# EAGLE schematic rectifier-power (EAGLE 5.07)
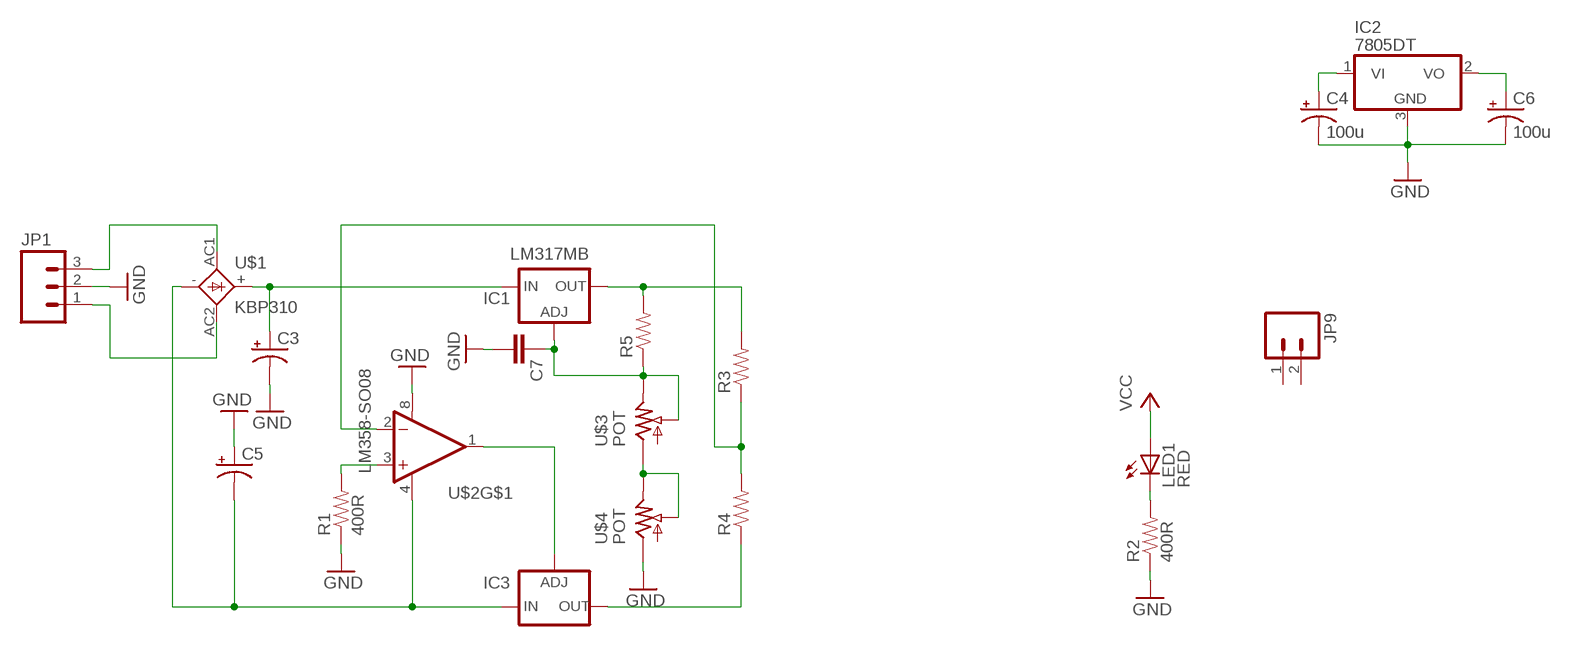
[diagram p0: schematic, sheet 1]

## Parts
C3  CAP_POLPTH3  [CPOL-RADIAL-1000UF-63V]
C4  100u  CAP_POLD  [PANASONIC_D]
C5  CAP_POLPTH3  [CPOL-RADIAL-1000UF-63V]
C6  100u  CAP_POLD  [PANASONIC_D]
C7  CAP-C1206  [C1206]
IC1  LM317MB  [TO220L1]
IC2  7805DT  [TO252]
IC3  LM337TL  [337TL]
JP1  M03-SCREW-5MM  [SCREWTERMINAL-5MM-3]
JP9  CON-02-XH  [XH-1X2-LONG-LOCK]
LED1  RED  LEDSIDELED  [OSRAM-SIDELED]
R1  400R  RESISTOR1/4W-RF  [AXIAL-0.3-SMD]
R2  400R  RESISTOR1/4W-RF  [AXIAL-0.3-SMD]
R3  RESISTOR1/4W-RF  [AXIAL-0.3-SMD]
R4  RESISTOR1/4W-RF  [AXIAL-0.3-SMD]
R5  RESISTOR-R0805W  [R0805W]
U$1  KBP310  RECTIFIER-BRIDGE  [KBP310]
U$2  LM358-SO08  [SO08]
U$3  POT  POTPANNEL  [POT-PANNEL]
U$4  POT  POTPANNEL  [POT-PANNEL]

## Nets
GND: C3.2(-) C4.- C5.1(+) C6.- C7.2 IC2.3(GND) JP1.2 R1.P$1 R2.P$1 U$2.8(V+) U$4.A
N$1: C6.+ IC2.2(VO)
N$3: JP1.3 U$1.AC1
N$4: LED1.C R2.P$2
N$6: C4.+ IC2.1(VI)
N$7: JP1.1 U$1.AC2
N$9: C3.1(+) IC1.3(IN) U$1.+
N$10: C5.2(-) IC3.2(IN) U$1.- U$2.4(V-)
N$11: IC3.1(ADJ) U$2.1(OUT)
N$12: R1.P$2 U$2.3(+IN)
N$13: IC1.2(OUT) R3.P$2 R5.2
N$14: IC3.3(OUT) R4.P$1
N$17: C7.1 IC1.1(ADJ) R5.1 U$3.E U$3.S
N$18: U$3.A U$4.E U$4.S
N$21: R3.P$1 R4.P$2 U$2.2(-IN)
VCC: LED1.A
Unconnected: JP9.1 JP9.2 U$2.5(+IN) U$2.6(-IN) U$2.7(OUT)

## Library data of the parts
C3-C6 = digital-toy:CAP_POL: Capacitor Polarized These are standard SMD and PTH capacitors. Normally 10uF, 47uF, and 100uF in electrolytic and tantalum varieties. Always verify the external diameter of the through hole cap, it varies with capacity, voltage, and manufacturer. The EIA devices should be standard. PANASONIC_D size: 6.5mmx6.5mmx5.5mm, 100uf (taobao:6.3mmx5.5mm), same as CVL0605 153cvl0405 size: 4mmx4mmx5.5mm, 10uf (taobao:4mmx5.5mm) ct6032 typical 47uF Tantalum, comment by hyl.
C7 = digital-toy:CAP: Capacitor Standard 0603 ceramic capacitor, and 0.1" leaded capacitor.
IC1 = v-reg:LM317?*: 500 mA Adjustable Output Positive Voltage Regulator Source: http://www.onsemi.co.jp .. LM317M-D.PDF
IC2 = linear:78*: Positive VOLTAGE REGULATOR Source: http://cache.national.com/ds/LM/LM78L05.pdf http://www.fairchildsemi.com/ds/LM/LM7805.pdf
IC3 = v-reg:LM337TL: VOLTAGE REGULATOR
JP1 = SparkFun:M03: Header 3 Standard 3-pin 0.1" header. Use with straight break away headers (SKU : PRT-00116), right angle break away headers (PRT-00553), swiss pins (PRT-00743), machine pins (PRT-00117), and female headers (PRT-00115). Molex polarized connector foot print use with SKU : PRT-08232 with associated crimp pins and housings.
JP9 = digital-toy:CON-02: Header 2 Standard 2-pin 0.1" header. Use with straight break away headers (SKU : PRT-00116), right angle break away headers (PRT-00553), swiss pins (PRT-00743), machine pins (PRT-00117), and female headers (PRT-00115). Molex polarized connector foot print use with SKU : PRT-08233 with associated crimp pins and housings.
LED1 = led:LED: LED OSRAM: - CHIPLED LG R971, LG N971, LY N971, LG Q971, LY Q971, LO R971, LY R971 LH N974, LH R974 LS Q976, LO Q976, LY Q976 LO Q996 - Hyper CHIPLED LW Q18S LB Q993, LB Q99A, LB R99A - SideLED LS A670, LO A670, LY A670, LG A670, LP A670 LB A673, LV A673, LT A673, LW A673 LH A674 LY A675 LS A676, LA A676, LO A676, LY A676, LW A676 LS A679, LY A679, LG A679 - Hyper Micro SIDELED® LS Y876, LA Y876, LO Y876, LY Y876 LT Y87S - SmartLED LW L88C, LW L88S LB L89C, LB L89S, LG L890 LS L89K, LO L89K, LY L89K LS L896, LA L896, LO L896, LY L896 - TOPLED LS T670, LO T670, LY T670, LG T670, LP T670 LSG T670, LSP T670, LSY T670, LOP T670, LYG T670 LG T671, LOG T671, LSG T671 LB T673, LV T673, LT T673, LW T673 LH T674 LS T676, LA T676, LO T676, LY T676, LB T676, LH T676, LSB T676, LW T676 LB T67C, LV T67C, LT T67C, LS T67K, LO T67K, LY T67K, LW E67C LS E67B, LA E67B, LO E67B, LY E67B, LB E67C, LV E67C, LT E67C LW T67C LS T679, LY T679, LG T679 LS T770, LO T770, LY T770, LG T770, LP T770 LB T773, LV T773, LT T773, LW T773 LH T774 LS E675, LA E675, LY E675, LS T675 LS T776, LA T776, LO T776, LY T776, LB T776 LHGB T686 LT T68C, LB T68C - Hyper Mini TOPLED® LB M676 - Mini TOPLED Santana® LG M470 LS M47K, LO M47K, LY M47K Source: http://www.osram.convergy.de LUXEON: - LUMILED® LXK2-PW12-R00, LXK2-PW12-S00, LXK2-PW14-U00, LXK2-PW14-V00 LXK2-PM12-R00, LXK2-PM12-S00, LXK2-PM14-U00 LXK2-PE12-Q00, LXK2-PE12-R00, LXK2-PE12-S00, LXK2-PE14-T00, LXK2-PE14-U00 LXK2-PB12-K00, LXK2-PB12-L00, LXK2-PB12-M00, LXK2-PB14-N00, LXK2-PB14-P00, LXK2-PB14-Q00 LXK2-PR12-L00, LXK2-PR12-M00, LXK2-PR14-Q00, LXK2-PR14-R00 LXK2-PD12-Q00, LXK2-PD12-R00, LXK2-PD12-S00 LXK2-PH12-R00, LXK2-PH12-S00 LXK2-PL12-P00, LXK2-PL12-Q00, LXK2-PL12-R00 Source: www.luxeon.com KINGBRIGHT: KA-3528ASYC Source: www.kingbright.com
R1-R5 = digital-toy:RESISTOR: Resistor Basic schematic elements and footprints for 0603, 1206, and PTH 1/10th watt (small) resistors. digital-toy copy vertical mount of axial-0.3 from rcl.lbr : the 0207/xx
U$1 = digital-toy:RECTIFIER-BRIDGE: refctifier bridge kbp310:14.4mmx11.1mm by hyl dtoy 2011/4/16
U$2 = digital-toy:LM358
U$3 U$4 = digital-toy:POT: POT digital toy POT, 3296 multi turn, blue-white ... hyl 8/07/2001